# EAGLE design noise-fob-no-fill (EAGLE 9.2.2)
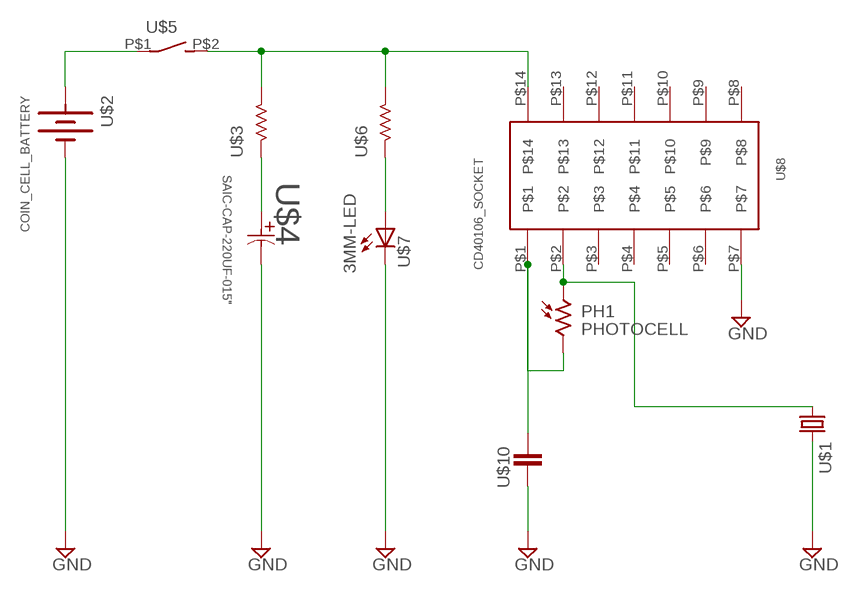
[diagram p0: schematic, sheet 1]

## Parts
PH1  PHOTOCELL  [PHOTOCELL]
U$1  PIEZO_BUZZER_2  [PIEZO_BUZZER_2]
U$2  COIN_CELL_BATTERY  [COIN_BATTERY]
U$3  RESISTOR-1/4W-THROUGH-HOLE  [1/4W_TH_RESISTOR]
U$4  SAIC-CAP-220UF-015"  [SAIC-CAP-0.15"-LEAD-SPACING-01]
U$5  TACTILE_SWITCH  [TACTILE_SWITCH]
U$6  RESISTOR-1/4W-THROUGH-HOLE  [1/4W_TH_RESISTOR]
U$7  3MM-LED  [LED3MM]
U$8  CD40106_SOCKET  [DIP_14_SOCKET]
U$10  SAIC-CAP-0.1UF-02"  [SAIC-CAP-0.2"-LEAD-SPACING-03]

## Nets
GND: U$1.P$2 U$2.P$2(-) U$4.P$2 U$7.K U$8.P$7 U$10.P$1
N$1: U$2.P$1(+) U$5.P$1(P)
N$2: U$3.P$2 U$5.P$2(S) U$6.P$2 U$8.P$14
N$3: U$3.P$1 U$4.P$1
N$4: U$6.P$1 U$7.A
N$5: PH1.P$1 U$1.P$1 U$8.P$2
N$6: PH1.P$2 U$8.P$1 U$10.P$2
Unconnected: U$8.P$3 U$8.P$4 U$8.P$5 U$8.P$6 U$8.P$8 U$8.P$9 U$8.P$10 U$8.P$11 U$8.P$12 U$8.P$13

## Library data of the parts
PH1 = MODEL2OBJECT:PHOTOCELL: Photo Sensor
U$1 = MODEL2OBJECT:PIEZO_BUZZER_2
U$2 = MODEL2OBJECT:COIN_CELL_BATTERY
U$3 U$6 = MODEL2OBJECT:RESISTOR-1/4W-THROUGH-HOLE
U$4 = MODEL2OBJECT:SAIC-CAP-220UF-015"
U$5 = MODEL2OBJECT:TACTILE_SWITCH
U$7 = MODEL2OBJECT:3MM-LED
U$8 = MODEL2OBJECT:CD40106_SOCKET
U$10 = MODEL2OBJECT:SAIC-CAP-0.1UF-02"

## Board
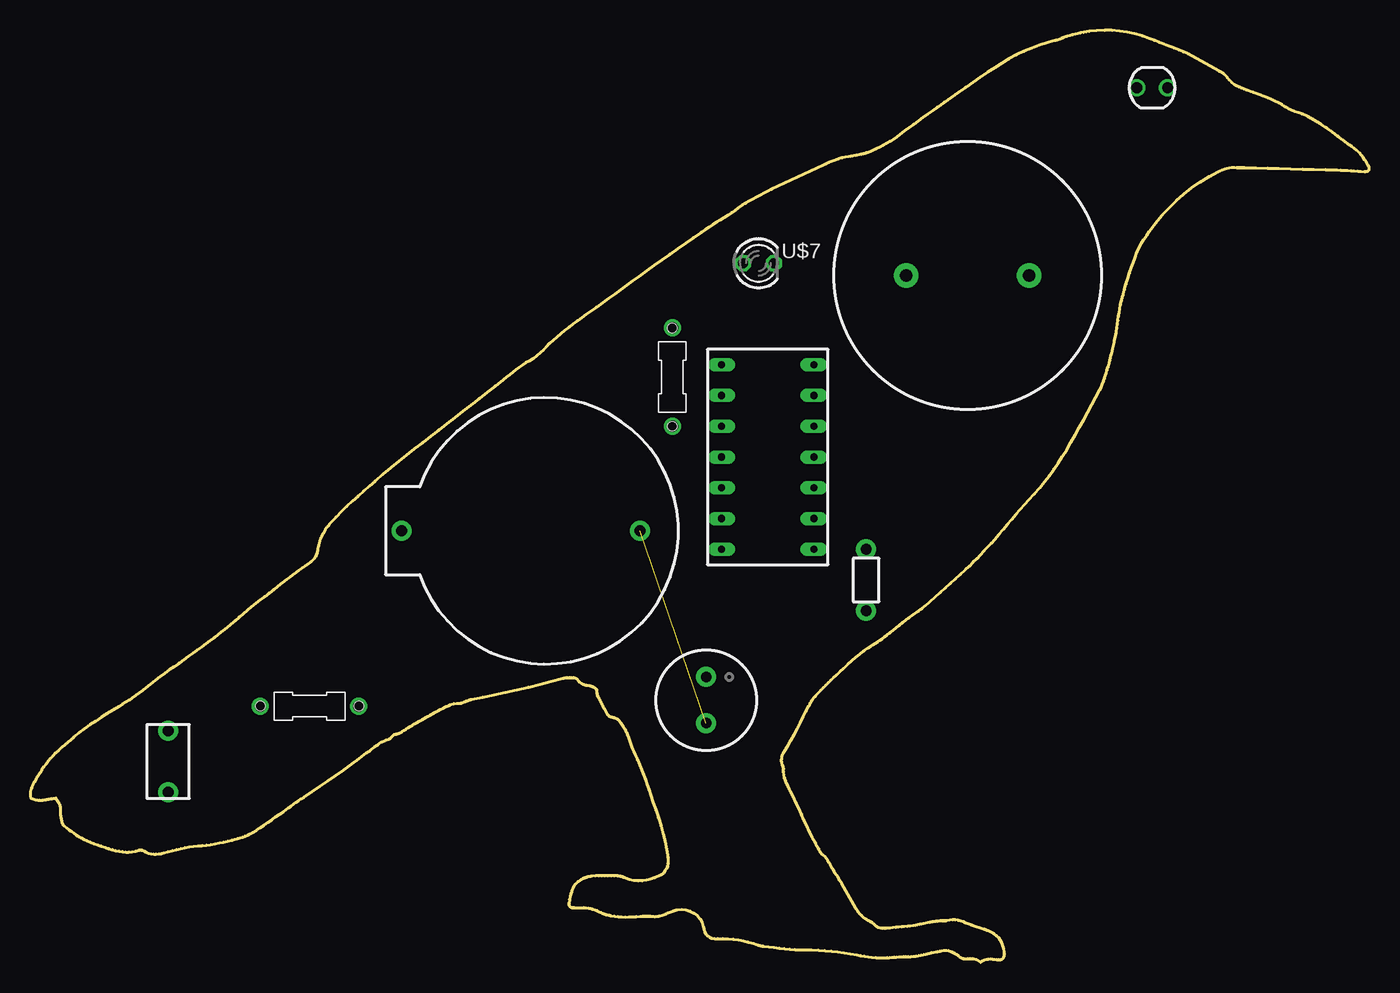
[diagram p1: board, top side]
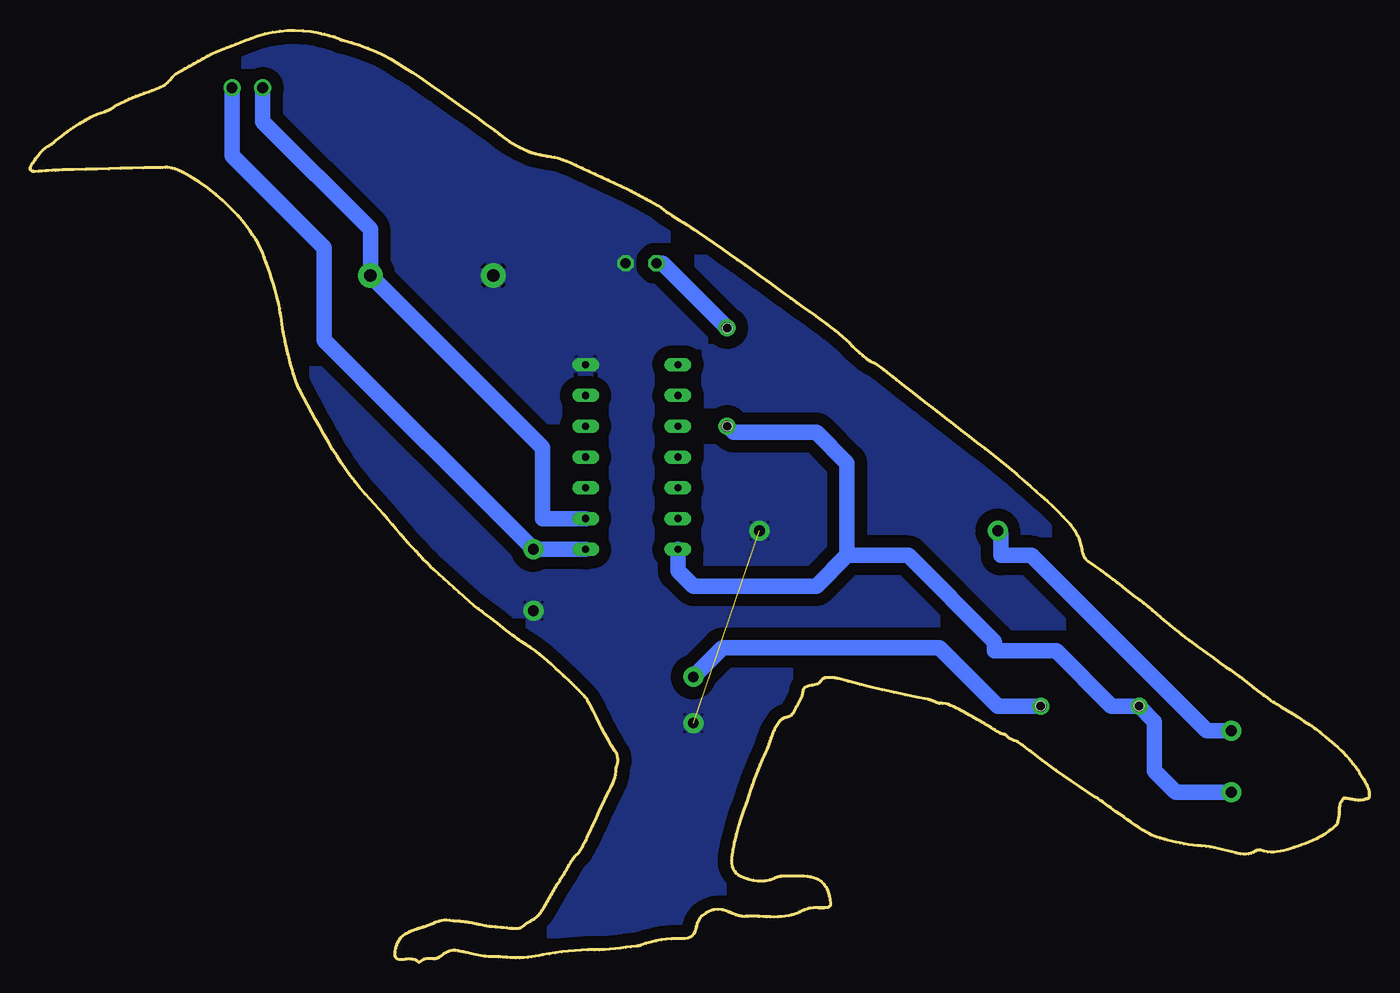
[diagram p2: board, bottom side, seen from below]

Size 110.6 x 76.97 mm. Coordinates in mm from the lower left corner, seen from the top.
Outline: 78.48,0 78.64,0.12 78.8,0.21 78.96,0.26 79.13,0.28 79.3,0.29 79.47,0.28 79.64,0.26 79.81,0.24 79.98,0.23 80.13,0.24 80.26,0.28 80.35,0.34 80.42,0.43 80.46,0.55 80.47,0.69 80.45,0.87 80.4,1.13 80.34,1.38 80.25,1.62 80.13,1.84 79.99,2.04 79.82,2.22 79.61,2.38 79.36,2.51 79.27,2.55 79.18,2.58 79.09,2.62 78.99,2.65 78.9,2.69 78.81,2.72 78.71,2.75 78.62,2.79 78.48,2.83 78.34,2.88 78.21,2.92 78.07,2.97 77.93,3.01 77.79,3.06 77.66,3.11 77.52,3.16 77.3,3.26 77.08,3.34 76.86,3.42 76.63,3.48 76.4,3.51 76.17,3.52 75.93,3.5 75.69,3.45 75.65,3.44 75.6,3.44 75.55,3.43 75.51,3.44 75.46,3.44 75.41,3.44 75.37,3.44 75.32,3.44 75.19,3.42 75.06,3.41 74.93,3.4 74.8,3.39 74.67,3.37 74.53,3.36 74.4,3.34 74.28,3.32 74.11,3.29 73.94,3.25 73.77,3.21 73.6,3.17 73.44,3.14 73.27,3.1 73.1,3.07 72.93,3.04 72.69,3.01 72.45,2.98 72.2,2.96 71.96,2.93 71.72,2.91 71.47,2.89 71.23,2.87 70.99,2.84 70.83,2.83 70.67,2.82 70.51,2.81 70.36,2.82 70.21,2.84 70.07,2.88 69.94,2.95 69.82,3.04 69.69,3.16 69.54,3.26 69.39,3.36 69.24,3.45 69.09,3.53 68.95,3.63 68.81,3.73 68.68,3.84 68.61,3.91 68.55,3.99 68.49,4.06 68.42,4.14 68.36,4.22 68.31,4.3 68.25,4.38 68.2,4.46 68.03,4.75 67.86,5.04 67.69,5.33 67.53,5.62 67.36,5.92 67.19,6.21 67.02,6.5 66.85,6.79 66.78,6.91 66.71,7.02 66.63,7.14 66.56,7.25 66.48,7.37 66.4,7.49 66.33,7.6 66.26,7.72 66.17,7.89 66.07,8.07 65.98,8.24 65.88,8.41 65.77,8.58 65.65,8.73 65.51,8.87 65.35,9 65.32,9.02 65.29,9.05 65.27,9.08 65.25,9.11 65.23,9.15 65.21,9.18 65.19,9.22 65.17,9.25 65.1,9.39 65.02,9.52 64.95,9.65 64.88,9.79 64.8,9.92 64.73,10.06 64.66,10.19 64.6,10.33 64.37,10.8 64.15,11.28 63.92,11.76 63.7,12.24 63.48,12.72 63.25,13.19 63.02,13.67 62.79,14.14 62.68,14.36 62.57,14.58 62.47,14.8 62.38,15.03 62.31,15.26 62.25,15.49 62.22,15.73 62.22,15.98 62.21,16.02 62.21,16.06 62.2,16.1 62.19,16.14 62.17,16.17 62.16,16.21 62.14,16.25 62.13,16.29 62.09,16.44 62.07,16.6 62.06,16.75 62.07,16.9 62.1,17.04 62.15,17.19 62.21,17.32 62.29,17.45 62.58,17.9 62.85,18.37 63.11,18.83 63.36,19.31 63.6,19.79 63.84,20.26 64.08,20.74 64.33,21.22 64.39,21.33 64.45,21.44 64.51,21.55 64.58,21.65 64.65,21.76 64.72,21.86 64.8,21.96 64.88,22.05 65.08,22.27 65.29,22.48 65.5,22.69 65.71,22.9 65.92,23.11 66.13,23.31 66.35,23.52 66.57,23.72 66.9,24.01 67.21,24.31 67.53,24.6 67.85,24.9 68.18,25.19 68.52,25.46 68.87,25.72 69.23,25.97 69.43,26.09 69.62,26.22 69.82,26.34 70.01,26.47 70.2,26.61 70.39,26.74 70.57,26.88 70.76,27.02 71.02,27.22 71.28,27.42 71.54,27.62 71.8,27.83 72.06,28.03 72.32,28.24 72.58,28.44 72.84,28.64 72.97,28.75 73.11,28.85 73.25,28.95 73.39,29.05 73.53,29.15 73.67,29.25 73.81,29.36 73.94,29.47 74.36,29.83 74.77,30.2 75.19,30.56 75.61,30.93 76.02,31.3 76.43,31.67 76.84,32.05 77.25,32.43 77.56,32.73 77.87,33.04 78.18,33.35 78.48,33.66 78.78,33.98 79.08,34.3 79.37,34.62 79.66,34.94 80.02,35.35 80.37,35.76 80.72,36.17 81.07,36.59 81.42,37.01 81.77,37.42 82.13,37.82 82.5,38.21 82.95,38.69 83.37,39.18 83.78,39.69 84.17,40.2 84.54,40.73 84.91,41.26 85.26,41.8 85.6,42.35 85.97,42.95 86.32,43.56 86.67,44.18 87.01,44.8 87.35,45.42 87.68,46.04 88.02,46.67 88.35,47.3 88.45,47.51 88.55,47.73 88.64,47.96 88.72,48.19 88.8,48.42 88.87,48.66 88.94,48.89 89.02,49.12 89.07,49.32 89.13,49.52 89.18,49.72 89.23,49.92 89.27,50.12 89.32,50.32 89.36,50.52 89.41,50.71 89.45,50.88 89.49,51.05 89.53,51.22 89.56,51.38 89.6,51.55 89.63,51.72 89.67,51.89 89.7,52.06 89.75,52.38 89.8,52.7 89.84,53.02 89.89,53.34 89.94,53.66 89.99,53.98 90.06,54.29 90.13,54.61 90.25,55.07 90.37,55.53 90.51,55.98 90.65,56.44 90.79,56.89 90.94,57.34 91.1,57.79 91.26,58.24 91.42,58.63 91.59,59 91.78,59.36 91.99,59.72 92.21,60.06 92.44,60.39 92.69,60.72 92.94,61.04 93.49,61.68 94.06,62.29 94.65,62.88 95.27,63.43 95.93,63.95 96.61,64.43 97.33,64.88 98.08,65.28 98.27,65.37 98.46,65.45 98.65,65.52 98.84,65.57 99.03,65.62 99.23,65.64 99.43,65.65 99.64,65.63 99.72,65.63 99.8,65.62 99.88,65.62 99.96,65.62 100.04,65.62 100.12,65.63 100.2,65.63 100.28,65.63 101.23,65.6 102.19,65.58 103.15,65.56 104.11,65.53 105.07,65.51 106.02,65.49 106.98,65.46 107.94,65.43 108.22,65.42 108.51,65.41 108.79,65.39 109.07,65.38 109.36,65.36 109.64,65.34 109.92,65.32 110.21,65.31 110.26,65.31 110.31,65.31 110.36,65.32 110.42,65.33 110.47,65.34 110.51,65.36 110.55,65.38 110.57,65.41 110.59,65.45 110.59,65.5 110.6,65.55 110.59,65.6 110.58,65.66 110.57,65.71 110.55,65.76 110.52,65.8 110.38,66.02 110.23,66.24 110.08,66.45 109.93,66.67 109.76,66.87 109.58,67.05 109.38,67.22 109.15,67.37 109.06,67.43 108.97,67.49 108.88,67.55 108.8,67.61 108.72,67.68 108.63,67.74 108.55,67.81 108.47,67.87 108,68.24 107.53,68.59 107.06,68.93 106.57,69.25 106.07,69.55 105.55,69.82 105.01,70.06 104.45,70.26 104.35,70.29 104.25,70.33 104.16,70.37 104.06,70.42 103.97,70.47 103.87,70.52 103.78,70.57 103.69,70.63 103.4,70.81 103.1,70.97 102.79,71.13 102.48,71.28 102.17,71.41 101.85,71.54 101.53,71.66 101.2,71.77 101,71.84 100.8,71.91 100.6,71.98 100.4,72.05 100.2,72.13 100.01,72.21 99.81,72.29 99.62,72.38 99.54,72.42 99.46,72.47 99.39,72.53 99.31,72.6 99.24,72.67 99.17,72.74 99.11,72.81 99.04,72.88 98.98,72.94 98.92,73.01 98.87,73.07 98.81,73.14 98.76,73.21 98.7,73.27 98.64,73.32 98.57,73.37 98.21,73.58 97.84,73.8 97.48,74.01 97.11,74.22 96.74,74.43 96.37,74.63 95.99,74.82 95.62,75.01 95.23,75.19 94.83,75.35 94.43,75.51 94.03,75.67 93.63,75.82 93.23,75.97 92.83,76.13 92.43,76.28 91.82,76.51 91.21,76.68 90.6,76.82 89.98,76.91 89.35,76.96 88.72,76.97 88.09,76.94 87.45,76.87 87.22,76.83 86.99,76.79 86.77,76.75 86.54,76.7 86.32,76.64 86.09,76.59 85.87,76.53 85.65,76.47 85.53,76.44 85.41,76.39 85.29,76.35 85.18,76.3 85.06,76.25 84.94,76.2 84.83,76.16 84.71,76.13 84.03,75.96 83.36,75.75 82.71,75.5 82.08,75.23 81.46,74.93 80.84,74.6 80.25,74.25 79.66,73.89 79.05,73.49 78.46,73.09 77.86,72.69 77.27,72.28 76.68,71.86 76.09,71.45 75.5,71.03 74.91,70.62 74.53,70.34 74.14,70.07 73.75,69.79 73.37,69.51 72.98,69.23 72.6,68.95 72.22,68.66 71.85,68.37 71.58,68.17 71.31,67.98 71.03,67.8 70.75,67.63 70.46,67.47 70.17,67.32 69.87,67.17 69.58,67.02 69.48,66.98 69.38,66.94 69.29,66.91 69.19,66.87 69.08,66.84 68.98,66.81 68.88,66.79 68.78,66.76 68.63,66.73 68.48,66.7 68.34,66.66 68.19,66.64 68.04,66.61 67.89,66.58 67.74,66.56 67.59,66.54 67.32,66.49 67.05,66.43 66.78,66.35 66.52,66.26 66.26,66.16 66.01,66.05 65.75,65.94 65.5,65.83 64.97,65.58 64.43,65.34 63.9,65.1 63.36,64.85 62.83,64.6 62.3,64.35 61.77,64.1 61.24,63.84 60.93,63.69 60.61,63.53 60.3,63.36 60,63.2 59.69,63.03 59.38,62.86 59.08,62.69 58.78,62.51 58.66,62.45 58.56,62.37 58.45,62.29 58.35,62.21 58.25,62.12 58.14,62.04 58.04,61.96 57.93,61.89 57.62,61.69 57.3,61.49 56.99,61.3 56.67,61.1 56.36,60.9 56.05,60.71 55.74,60.5 55.43,60.3 54.78,59.84 54.13,59.39 53.48,58.93 52.83,58.48 52.18,58.02 51.54,57.56 50.89,57.1 50.25,56.64 49.75,56.28 49.25,55.92 48.76,55.55 48.26,55.19 47.77,54.83 47.27,54.47 46.77,54.11 46.27,53.76 45.9,53.5 45.54,53.25 45.19,52.99 44.83,52.72 44.48,52.45 44.13,52.18 43.79,51.9 43.45,51.62 43.17,51.37 42.9,51.11 42.64,50.84 42.38,50.58 42.11,50.32 41.82,50.08 41.52,49.86 41.18,49.66 40.9,49.5 40.63,49.32 40.36,49.13 40.09,48.93 39.84,48.72 39.58,48.51 39.32,48.3 39.06,48.1 38.39,47.58 37.72,47.06 37.05,46.55 36.39,46.03 35.72,45.51 35.05,44.99 34.38,44.47 33.72,43.95 33.05,43.43 32.39,42.92 31.72,42.41 31.06,41.89 30.4,41.37 29.75,40.84 29.11,40.3 28.47,39.75 28,39.34 27.53,38.92 27.06,38.51 26.6,38.09 26.14,37.66 25.69,37.22 25.24,36.78 24.82,36.32 24.7,36.18 24.59,36.04 24.48,35.89 24.38,35.73 24.28,35.58 24.19,35.42 24.1,35.26 24.02,35.09 23.96,34.94 23.91,34.79 23.87,34.63 23.83,34.47 23.79,34.31 23.76,34.14 23.72,33.98 23.68,33.82 23.65,33.71 23.61,33.61 23.56,33.51 23.5,33.41 23.43,33.33 23.36,33.24 23.28,33.17 23.18,33.1 22.93,32.92 22.68,32.73 22.43,32.55 22.18,32.37 21.93,32.18 21.68,32 21.43,31.81 21.19,31.63 20.82,31.35 20.45,31.06 20.08,30.78 19.72,30.5 19.35,30.22 18.99,29.93 18.63,29.64 18.26,29.35 17.92,29.07 17.58,28.79 17.24,28.51 16.91,28.22 16.57,27.93 16.23,27.65 15.89,27.37 15.54,27.1 15.19,26.83 14.83,26.56 14.48,26.3 14.12,26.04 13.76,25.78 13.4,25.52 13.04,25.26 12.68,25 12.28,24.72 11.88,24.43 11.48,24.15 11.09,23.87 10.69,23.58 10.3,23.29 9.91,22.99 9.54,22.68 9.27,22.46 9,22.25 8.72,22.05 8.44,21.86 8.15,21.67 7.86,21.49 7.58,21.3 7.29,21.12 6.81,20.83 6.33,20.53 5.86,20.23 5.39,19.92 4.92,19.61 4.46,19.29 4.02,18.95 3.58,18.6 3.33,18.39 3.08,18.18 2.84,17.97 2.59,17.75 2.35,17.53 2.12,17.31 1.89,17.08 1.68,16.84 1.49,16.62 1.31,16.39 1.13,16.15 0.96,15.9 0.8,15.65 0.65,15.4 0.49,15.15 0.34,14.89 0.26,14.74 0.18,14.59 0.11,14.43 0.05,14.26 0.01,14.09 0,13.92 0.01,13.74 0.06,13.55 0.2,13.51 0.33,13.47 0.47,13.43 0.61,13.41 0.74,13.39 0.88,13.39 1.02,13.4 1.16,13.42 1.28,13.45 1.4,13.47 1.52,13.49 1.64,13.51 1.76,13.52 1.88,13.54 1.99,13.55 2.11,13.57 2.2,13.44 2.29,13.32 2.36,13.19 2.41,13.07 2.45,12.94 2.48,12.8 2.49,12.66 2.49,12.52 2.48,12.41 2.48,12.31 2.49,12.2 2.51,12.1 2.52,11.99 2.54,11.89 2.57,11.78 2.59,11.68 2.6,11.62 2.62,11.57 2.63,11.51 2.66,11.45 2.68,11.39 2.71,11.35 2.75,11.3 2.79,11.27 2.98,11.12 3.18,10.97 3.38,10.83 3.57,10.68 3.77,10.55 3.98,10.41 4.19,10.29 4.4,10.18 4.69,10.05 4.98,9.93 5.28,9.81 5.57,9.7 5.87,9.6 6.18,9.5 6.48,9.4 6.78,9.31 7.05,9.24 7.32,9.19 7.59,9.14 7.87,9.12 8.14,9.12 8.42,9.14 8.7,9.19 8.97,9.27 9.02,9.28 9.06,9.29 9.12,9.28 9.17,9.28 9.22,9.27 9.27,9.25 9.32,9.23 9.36,9.21 9.56,9.09 9.76,9.01 9.97,8.96 10.18,8.93 10.4,8.94 10.61,8.96 10.82,9 11.03,9.05 11.38,9.14 11.73,9.24 12.08,9.32 12.43,9.41 12.78,9.48 13.14,9.54 13.5,9.59 13.86,9.62 14.22,9.64 14.57,9.68 14.92,9.74 15.27,9.8 15.62,9.87 15.97,9.94 16.32,10.02 16.67,10.1 16.89,10.16 17.1,10.22 17.32,10.28 17.54,10.35 17.75,10.43 17.95,10.52 18.15,10.61 18.35,10.72 18.68,10.92 19.01,11.13 19.33,11.35 19.65,11.57 19.97,11.79 20.29,12.01 20.61,12.24 20.93,12.46 21.14,12.61 21.34,12.76 21.55,12.91 21.76,13.07 21.97,13.22 22.18,13.37 22.39,13.52 22.6,13.66 23.27,14.09 23.93,14.53 24.58,14.98 25.23,15.43 25.88,15.88 26.52,16.35 27.16,16.82 27.79,17.29 27.93,17.39 28.06,17.49 28.19,17.59 28.32,17.69 28.45,17.79 28.58,17.89 28.71,18 28.84,18.1 28.98,18.19 29.13,18.26 29.29,18.33 29.45,18.38 29.61,18.45 29.75,18.53 29.89,18.64 30,18.78 30.02,18.79 30.04,18.81 30.07,18.82 30.1,18.83 30.14,18.83 30.18,18.84 30.21,18.84 30.24,18.85 30.28,18.86 30.32,18.87 30.36,18.88 30.39,18.9 30.43,18.91 30.47,18.92 30.5,18.94 30.53,18.95 30.71,19.06 30.88,19.17 31.05,19.28 31.22,19.38 31.4,19.49 31.57,19.6 31.74,19.7 31.92,19.81 32.13,19.93 32.35,20.06 32.57,20.18 32.79,20.31 33.01,20.43 33.23,20.55 33.45,20.66 33.67,20.78 33.89,20.89 34.1,21 34.32,21.11 34.54,21.22 34.76,21.3 34.99,21.37 35.24,21.4 35.49,21.4 35.54,21.4 35.58,21.41 35.62,21.42 35.67,21.44 35.71,21.46 35.75,21.48 35.8,21.5 35.84,21.51 35.92,21.54 35.99,21.57 36.06,21.6 36.14,21.62 36.21,21.65 36.29,21.68 36.36,21.7 36.44,21.72 37.38,21.91 38.33,22.1 39.27,22.3 40.22,22.51 41.16,22.73 42.09,22.96 43.03,23.2 43.96,23.46 44.06,23.49 44.17,23.5 44.28,23.51 44.39,23.52 44.51,23.52 44.62,23.52 44.73,23.52 44.84,23.52 44.89,23.51 44.94,23.51 44.99,23.5 45.03,23.48 45.08,23.46 45.12,23.44 45.15,23.41 45.17,23.39 45.27,23.25 45.38,23.14 45.5,23.05 45.63,22.99 45.77,22.94 45.92,22.9 46.07,22.88 46.22,22.85 46.34,22.82 46.46,22.79 46.56,22.74 46.64,22.67 46.71,22.59 46.76,22.5 46.79,22.38 46.8,22.24 46.81,22.2 46.81,22.16 46.82,22.13 46.82,22.09 46.84,22.05 46.85,22.01 46.86,21.97 46.88,21.94 46.96,21.78 47.05,21.61 47.13,21.45 47.22,21.29 47.31,21.13 47.39,20.97 47.47,20.81 47.56,20.64 47.6,20.57 47.65,20.5 47.7,20.43 47.76,20.38 47.83,20.34 47.9,20.3 47.99,20.27 48.08,20.25 48.15,20.23 48.23,20.21 48.31,20.18 48.38,20.16 48.45,20.12 48.52,20.08 48.58,20.04 48.63,19.99 48.72,19.87 48.8,19.76 48.88,19.64 48.96,19.51 49.04,19.39 49.11,19.26 49.17,19.13 49.23,19 49.33,18.77 49.42,18.54 49.5,18.3 49.59,18.07 49.67,17.83 49.76,17.6 49.86,17.36 49.96,17.14 50.15,16.73 50.32,16.33 50.49,15.92 50.65,15.51 50.81,15.09 50.95,14.68 51.1,14.26 51.24,13.84 51.46,13.2 51.67,12.57 51.89,11.93 52.09,11.29 52.27,10.64 52.44,9.99 52.57,9.33 52.67,8.66 52.69,8.41 52.67,8.18 52.63,7.95 52.55,7.74 52.44,7.55 52.3,7.38 52.12,7.24 51.91,7.12 51.58,6.98 51.24,6.87 50.9,6.79 50.55,6.74 50.21,6.73 49.86,6.76 49.51,6.84 49.15,6.97 49.07,7 48.99,7.04 48.91,7.06 48.83,7.09 48.74,7.11 48.66,7.12 48.58,7.14 48.49,7.14 48.24,7.15 47.98,7.15 47.72,7.16 47.46,7.16 47.2,7.16 46.95,7.15 46.69,7.14 46.43,7.13 46.31,7.12 46.19,7.09 46.07,7.07 45.95,7.03 45.83,6.99 45.71,6.94 45.6,6.89 45.49,6.84 45.23,6.67 45.03,6.47 44.87,6.24 44.75,6 44.67,5.73 44.6,5.46 44.54,5.18 44.49,4.9 44.48,4.82 44.49,4.74 44.52,4.68 44.56,4.63 44.61,4.59 44.68,4.55 44.75,4.53 44.83,4.52 44.92,4.52 45.01,4.51 45.09,4.51 45.18,4.51 45.26,4.51 45.35,4.51 45.44,4.51 45.52,4.52 45.72,4.52 45.91,4.51 46.1,4.49 46.28,4.46 46.46,4.41 46.64,4.35 46.82,4.27 47,4.18 47.11,4.13 47.22,4.08 47.34,4.03 47.46,3.99 47.58,3.96 47.7,3.93 47.82,3.9 47.94,3.87 48.24,3.82 48.55,3.78 48.85,3.76 49.15,3.75 49.46,3.76 49.76,3.77 50.06,3.78 50.37,3.81 50.49,3.81 50.6,3.82 50.72,3.83 50.84,3.83 50.96,3.83 51.08,3.83 51.2,3.82 51.31,3.81 51.46,3.8 51.61,3.79 51.75,3.8 51.89,3.82 52.03,3.85 52.17,3.88 52.31,3.93 52.45,3.98 52.57,4.04 52.69,4.09 52.81,4.14 52.94,4.19 53.06,4.23 53.18,4.27 53.31,4.31 53.44,4.34 53.79,4.39 54.15,4.35 54.49,4.24 54.81,4.08 55.1,3.86 55.33,3.61 55.5,3.32 55.59,3.01 55.64,2.75 55.71,2.53 55.81,2.34 55.94,2.2 56.09,2.09 56.28,2.02 56.51,1.98 56.77,1.97 57.2,1.97 57.63,1.95 58.06,1.92 58.48,1.86 58.9,1.78 59.32,1.69 59.73,1.57 60.14,1.44 60.19,1.42 60.24,1.4 60.29,1.39 60.34,1.38 60.39,1.36 60.45,1.35 60.5,1.35 60.55,1.34 60.98,1.29 61.42,1.24 61.85,1.19 62.28,1.14 62.72,1.1 63.15,1.06 63.59,1.04 64.02,1.03 64.56,1.03 65.09,1.01 65.63,0.98 66.16,0.93 66.69,0.87 67.21,0.8 67.74,0.72 68.27,0.63 68.58,0.57 68.89,0.52 69.21,0.47 69.52,0.43 69.84,0.4 70.15,0.38 70.47,0.38 70.79,0.39 70.98,0.41 71.17,0.42 71.36,0.44 71.55,0.45 71.75,0.46 71.94,0.47 72.13,0.47 72.32,0.47 72.53,0.47 72.74,0.48 72.95,0.5 73.16,0.53 73.37,0.56 73.58,0.6 73.78,0.64 73.99,0.69 74.15,0.73 74.31,0.77 74.47,0.8 74.63,0.83 74.79,0.86 74.96,0.9 75.12,0.93 75.28,0.96 75.47,0.99 75.66,0.99 75.84,0.97 76.02,0.93 76.18,0.86 76.35,0.78 76.5,0.67 76.64,0.55 76.73,0.48 76.82,0.42 76.91,0.37 77,0.33 77.09,0.31 77.19,0.3 77.3,0.3 77.41,0.31 77.55,0.32 77.69,0.33 77.82,0.32 77.96,0.29 78.09,0.25 78.22,0.19 78.35,0.11 78.48,0
Copper layers (1*16): Top 0.035mm / dielectric 1.5mm / Bottom 0.035mm
Design rules "default": minimum track width 6mil, minimum drill 0.35mm, track to track 6mil, track to pad 6mil, pad to pad 6mil, via to via 6mil, smd to smd 6mil, copper to edge 40mil, drill to drill 6mil, minimum pad ring 10mil, minimum via ring 8mil, stop-mask expansion 4mil, vias tented up to drill 0mil, thermal gap 10mil

### Footprints (pad centres in the part's own frame; a part is rotated, then mirrored left to right if it is on the bottom)
PHOTOCELL = drill 0.889: P$1 0,0; P$2 0,-2.54
PIEZO_BUZZER_2 = drill 1.016 pad 2.032: P$1 0,0; P$2 0,10.16
COIN_BATTERY = drill 0.914 pad 1.651: P$1 0,0; P$2 0,-19.685
1/4W_TH_RESISTOR = drill 0.889: P$1 -4.064,0; P$2 4.064,0 | hole 0.762: -4.064,0; 4.064,0
SAIC-CAP-0.15"-LEAD-SPACING-01 = drill 0.889 pad 1.651: P$1 -1.905,0; P$2 1.905,0
TACTILE_SWITCH = drill 0.914 pad 1.651: P$1 0,0; P$2 0,-5.08
LED3MM = drill 0.813 octagon: A -1.27,0; K 1.27,0
DIP_14_SOCKET = drill 0.6 long: P$1 0,0; P$2 0,2.54; P$3 0,5.08; P$4 0,7.62; P$5 0,10.16; P$6 0,12.7; P$7 0,15.24; P$8 -7.62,15.24; P$9 -7.62,12.7; P$10 -7.62,10.16; P$11 -7.62,7.62; P$12 -7.62,5.08; P$13 -7.62,2.54; P$14 -7.62,0
SAIC-CAP-0.2"-LEAD-SPACING-03 = drill 0.889 pad 1.651: P$1 -2.54,0; P$2 2.54,0

### Placement (x,y rotation side)
PH1  91.39,72.21 90 top
U$1  82.5,56.72 90 top
U$2  30.69,35.64 90 top
U$3  23.07,21.16 180 top
U$4  55.83,21.67 270 top
U$5  11.38,19.13 0 top
U$6  53.04,48.34 270 top
U$7  60.15,57.74 0 top
U$8  64.72,34.11 0 top
U$10  69.04,31.57 90 top

### Tracks (layer width: path | path; a pad name or v marks a point on that pad's centre or on a via)
GND  (1 unrouted)
  pour Bottom (isolate 1.016): -2.59,-1.95 114.25,-1.95 114.25,79.33 -2.59,79.33
N$1
  Bottom 1.27: U$2.P$1 30.43,35.38 30.43,33.61 27.89,33.61 13.41,19.13 U$5.P$1
N$2
  Bottom 1.27: U$5.P$2 15.95,14.05 17.73,15.83 17.73,19.89 U$3.P$2 21.29,21.16 25.86,25.73 30.94,25.73 30.94,26.49 38.05,33.61 43.13,33.61 | U$6.P$2 52.53,43.77 45.67,43.77 43.13,41.23 43.13,33.61 | 43.13,33.61 45.67,31.07 55.83,31.07 57.1,32.34 U$8.P$14
N$3
  Bottom 1.27: U$3.P$1 30.69,21.16 35.51,25.99 53.42,25.99 U$4.P$1
N$4
  Bottom 1.27: U$6.P$1 58.37,57.74 U$7.A
N$5
  Bottom 1.27: U$8.P$2 68.28,36.65 68.28,42.5 U$1.P$1 82.5,60.53 91.39,69.42 PH1.P$1
N$6
  Bottom 1.27: U$8.P$1 U$10.P$2 86.31,51.39 86.31,59.01 93.93,66.63 PH1.P$2